# EasyEDA schematic EasyEDA_Source.json
TITLE: Meadow CCM Add-on Module - Solar, Power, Battery; REV: v1.d; Date: 2022.04; Sheet: 1/1; Drawn By: bryan costanich; Company: Wilderness Labs
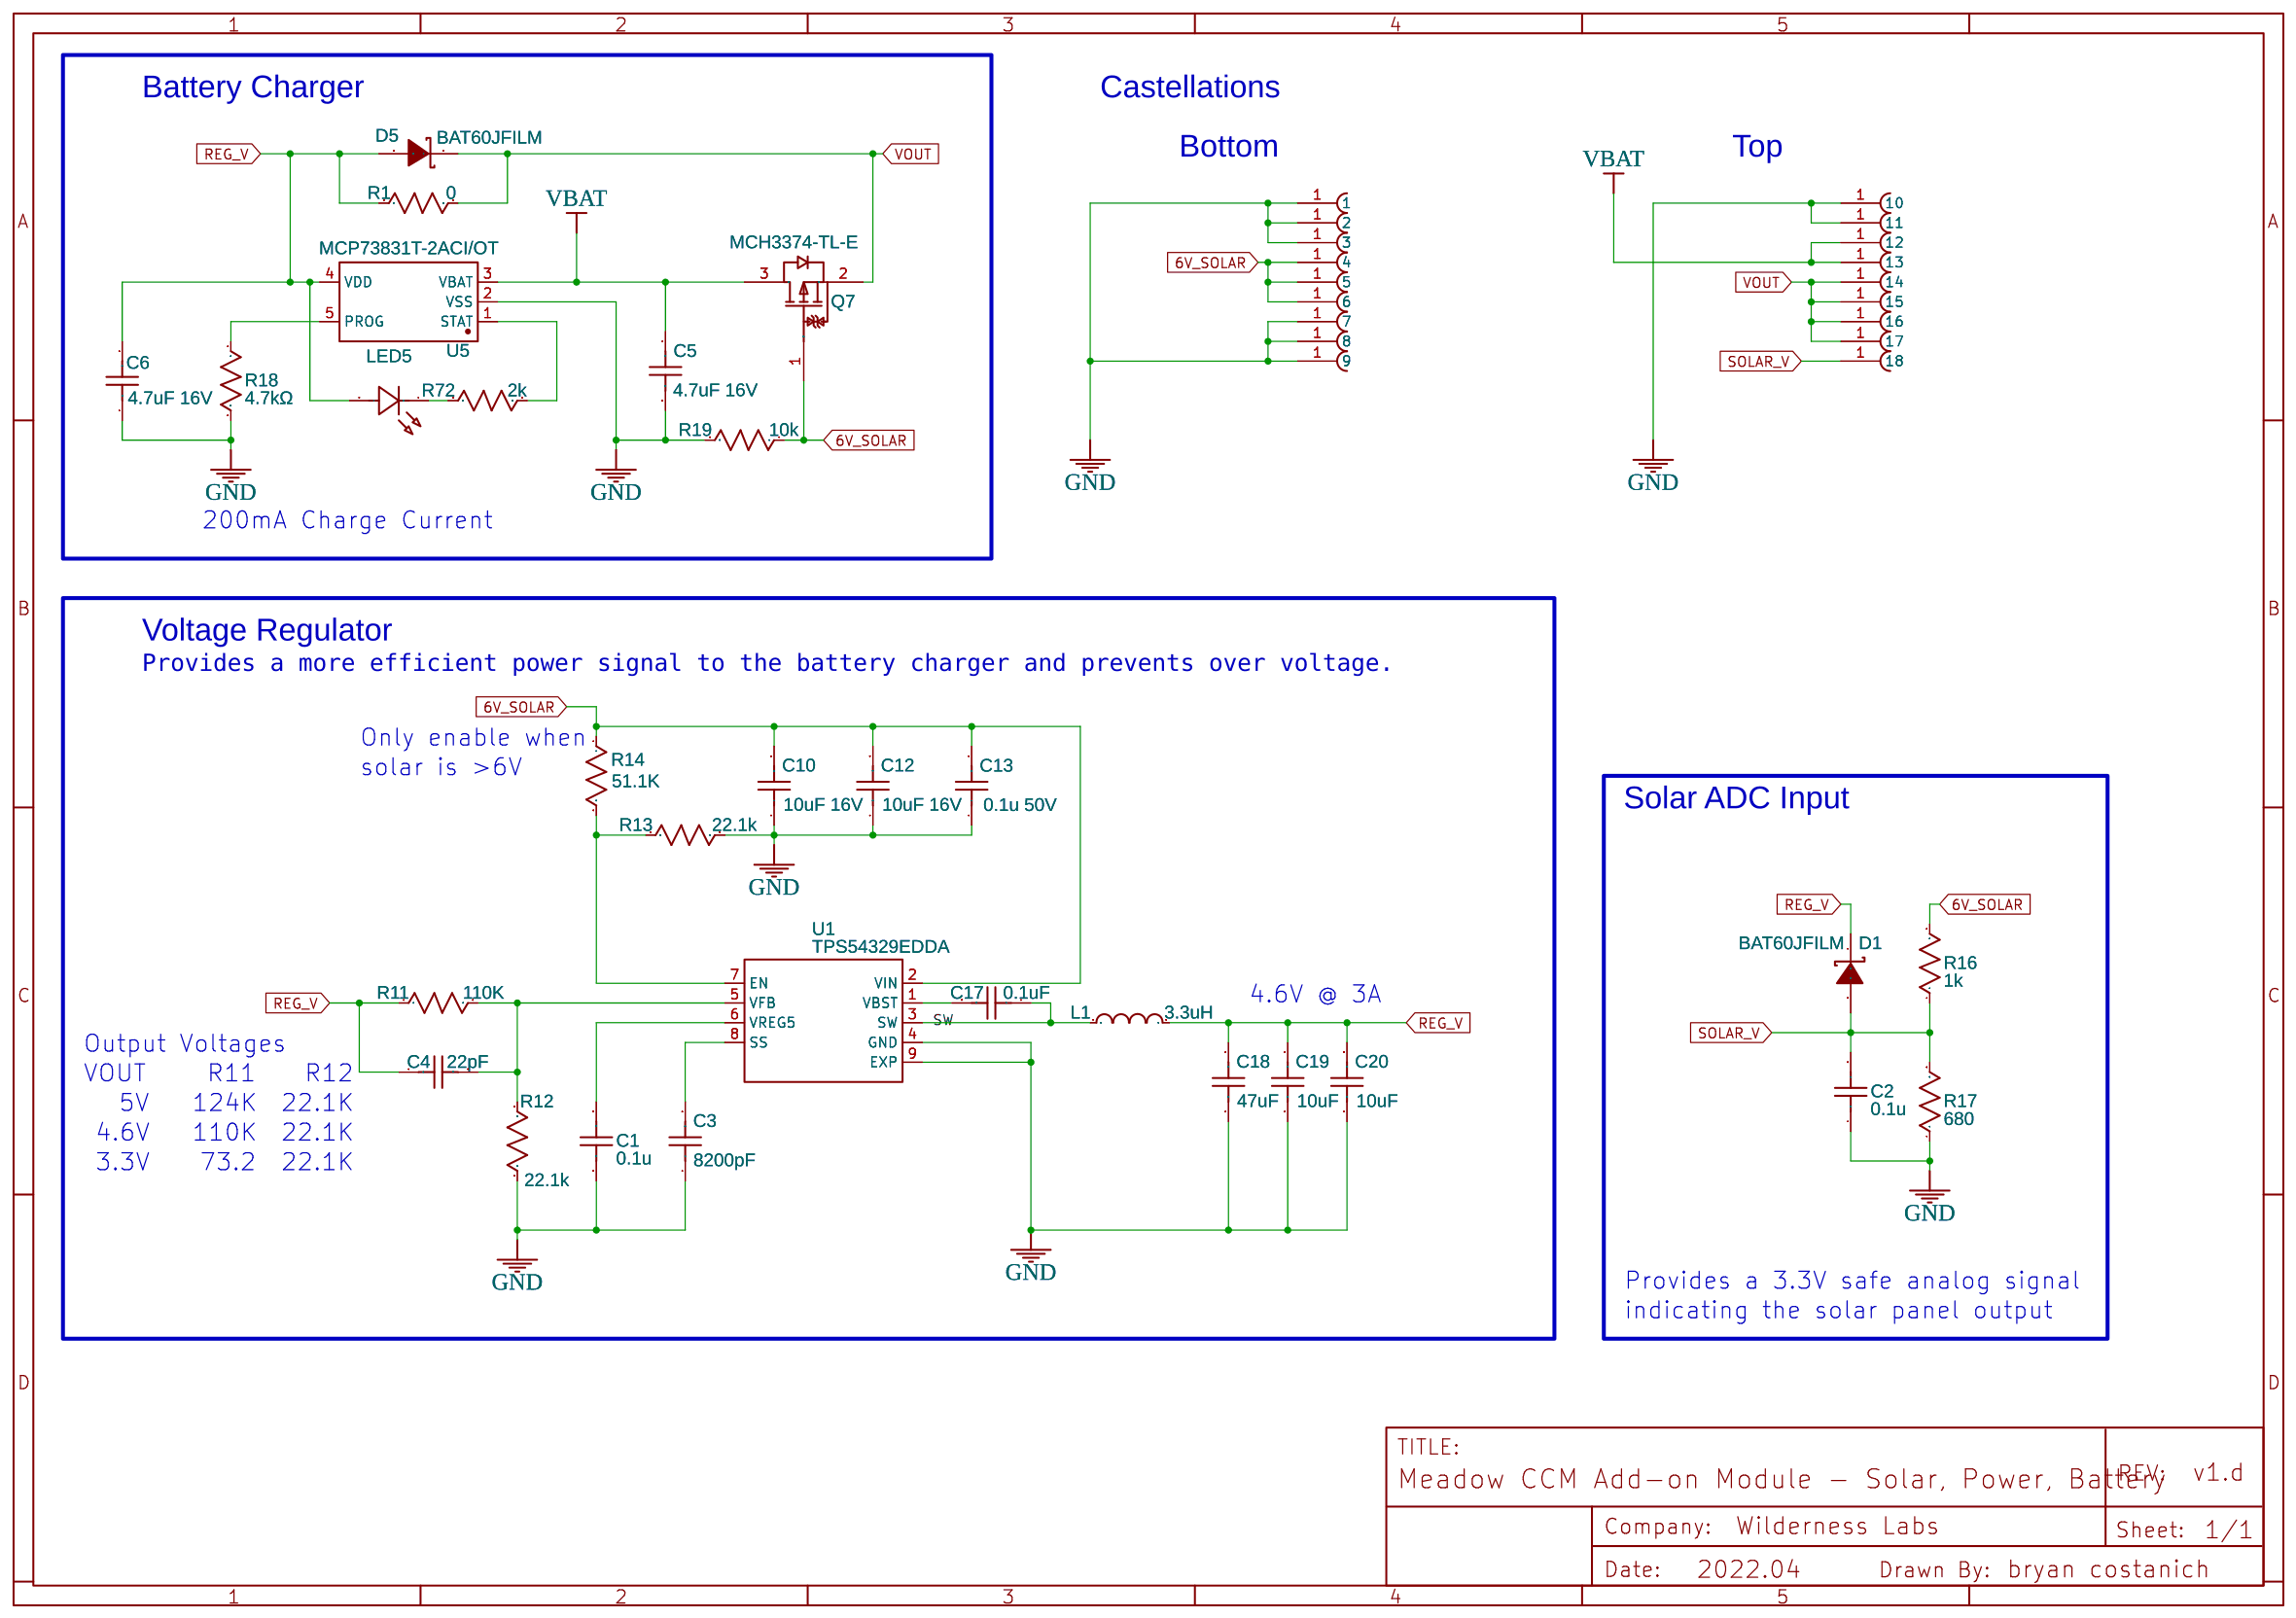
[diagram p0: schematic sheet]

## Parts
C1  0.1u  [C0603]
C2  0.1u  [C0603]
C3  8200pF  [C0603]
C4  22pF  [C0603]
C5  4.7uF 16V  [C0805]
C6  4.7uF 16V  [C0805]
C10  10uF 16V  [C0805]
C12  10uF 16V  [C0805]
C13  0.1u 50V  [C0603]
C17  0.1uF  [C0603]
C18  47uF  [C1210]
C19  10uF  [C0805]
C20  10uF  [C0805]
D1  BAT60JFILM  [SOD-323_L1.8-W1.3-LS2.5-RD]
D5  BAT60JFILM  [SOD-323_L1.8-W1.3-LS2.5-RD]
L1  3.3uH  [IND-SMD_L4.9-W4.9_NRS50XX]
LED5  EAST1608GA0  [LED0603-RD]
Q7  MCH3374-TL-E  [-ONSC-MCPH-3_V]
R1  0  [R0603]
R11  110K  [R0603]
R12  22.1k  [R0603]
R13  22.1k  [R0603]
R14  51.1K  [R0603]
R16  1k  [R0603]
R17  680  [R0603]
R18  4.7kΩ  [R0603]
R19  10k  [R0603]
R72  2k  [R0603]
U1  TPS54329EDDA  [SOIC-8_L5.0-W4.0-P1.27-LS6.0-BL-EP2.0]
U2  1.5MM SMT CASTELLATION  [1.5MM SMT CASTELLATION]
U3  1.5MM SMT CASTELLATION  [1.5MM SMT CASTELLATION]
U4  1.5MM SMT CASTELLATION  [1.5MM SMT CASTELLATION]
U5  MCP73831T-2ACI/OT  [SOT-23-5_L3.0-W1.7-P0.95-LS2.8-BR]
U6  1.5MM SMT CASTELLATION  [1.5MM SMT CASTELLATION]
U7  1.5MM SMT CASTELLATION  [1.5MM SMT CASTELLATION]
U8  1.5MM SMT CASTELLATION  [1.5MM SMT CASTELLATION]
U9  1.5MM SMT CASTELLATION  [1.5MM SMT CASTELLATION]
U10  1.5MM SMT CASTELLATION  [1.5MM SMT CASTELLATION]
U19  1.5MM SMT CASTELLATION  [1.5MM SMT CASTELLATION]
U20  1.5MM SMT CASTELLATION  [1.5MM SMT CASTELLATION]
U28  1.5MM SMT CASTELLATION  [1.5MM SMT CASTELLATION]
U29  1.5MM SMT CASTELLATION  [1.5MM SMT CASTELLATION]
U32  1.5MM SMT CASTELLATION  [1.5MM SMT CASTELLATION]
U33  1.5MM SMT CASTELLATION  [1.5MM SMT CASTELLATION]
U34  1.5MM SMT CASTELLATION  [1.5MM SMT CASTELLATION]
U35  1.5MM SMT CASTELLATION  [1.5MM SMT CASTELLATION]
U36  1.5MM SMT CASTELLATION  [1.5MM SMT CASTELLATION]
U37  1.5MM SMT CASTELLATION  [1.5MM SMT CASTELLATION]

## Library data of the parts
C1 C2 C13 C17 = C_0402_US: Contributor: LCEDA_Lib; Manufacturer Part: CC0603KRX7R9BB103; Manufacturer: Yageo
C3 = C_0603_US: Contributor: LCEDA_Lib; Manufacturer Part: CC0603KRX7R9BB822; Manufacturer: Yageo
C4 = C_0603_US: Contributor: LCEDA_Lib; Manufacturer Part: CC0603JRNPO9BN220; Manufacturer: Yageo
C5 C6 = C_0805_US: Contributor: LCEDA_Lib; Manufacturer Part: CC0805KKX7R7BB475; Manufacturer: Yageo
C10 C12 C19 C20 = C_0805_US: Contributor: LCEDA_Lib; Manufacturer Part: CC0805KRX5R7BB106; Manufacturer: Yageo
C18 = C_0402_US: Contributor: LCEDA_Lib; Manufacturer Part: CC1210KKX5R6BB476; Manufacturer: Yageo
D1 D5 = BAT60JFILM: Supplier: LCSC; Manufacturer: STMicroelectronics; Contributor: LCSC; Supplier Part: C133103; JLCPCB Part Class: Extended Part
L1 = NRS5040T3R3NMGJ: Supplier: LCSC; Supplier Part: C222946; Manufacturer: Taiyo Yuden; Contributor: LCSC; JLCPCB Part Class: Extended Part
LED5 = EAST1608GA0: Manufacturer: Everlight; Contributor: LCSC
Q7 = MCH3374-TL-E: P-Channel Power MOSFET, -12 V, -3 A, 70 mOhm, 3-Pin MCPH, Pb-Free, Tape and Reel; Manufacturer: OnSemi
R1 = R_0603_US: Contributor: LCEDA_Lib; Manufacturer Part: RC0603JR-070RL; Manufacturer: Yageo
R11 = R_0603_US: Contributor: LCEDA_Lib; Manufacturer Part: RC0603FR-07110KL; Manufacturer: Yageo
R12 R13 = R_0603_US: Contributor: LCEDA_Lib; Manufacturer Part: RC0603FR-0722K1L; Manufacturer: Yageo
R14 = R_0603_US: Contributor: LCEDA_Lib; Manufacturer Part: RC0603FR-0751K1L; Manufacturer: Yageo
R16 = R_0402_US: Contributor: LCEDA_Lib; Manufacturer Part: RC0603FR-071KL; Manufacturer: Yageo
R17 = R_0402_US: Contributor: LCEDA_Lib; Manufacturer Part: RC0603FR-07680RL; Manufacturer: Yageo
R18 = Res_0603(1/10W)_US: Manufacturer Part: RC0603FR-074K7L; Manufacturer: Yageo
R19 = R_0402_US: Contributor: LCEDA_Lib; Manufacturer Part: RC0603FR-0710KL; Manufacturer: Yageo
R72 = R_0603_US: Contributor: LCEDA_Lib; Manufacturer Part: RC0603FR-072KL; Manufacturer: Yageo
U1 = TPS54329EDDAR LOGICAL: Supplier: LCSC; Manufacturer: TI; Contributor: LCSC; Supplier Part: C38344; JLCPCB Part Class: Extended Part
U2-U4 U6-U10 U19 U20 U28 U29 U32-U37 = 1.5MM SMT CASTELLATION: Contributor: bryan_6020
U5 = MCP73831T-2ACI/OT: Supplier: LCSC; Supplier Part: C424093; Manufacturer: Microchip Tech; Contributor: LCSC; JLCPCB Part Class: Extended Part

## Nets
6V_SOLAR: C10.2 C12.2 C13.2 Q7.1(G) R14.1 R16.2 R19.1 U1.2(VIN) U32.1(6) U33.1(5) U34.1(4)
GND: C1.1 C2.1 C3.1 C5.2 C6.1 C10.1 C12.1 C13.1 C18.1 C19.1 C20.1 R12.1 R13.1 R17.1 R18.2 R19.2 U1.4(GND) U1.9(EXP) U3.1(7) U5.2(VSS) U19.1(8) U20.1(9) U28.1(10) U29.1(11) U35.1 U36.1(2) U37.1(3)
VBAT: C5.1 Q7.3(D) U2.1(12) U5.3(VBAT) U9.1(13)
REG_V: C4.1 C6.2 C18.2 C19.2 C20.2 D1.1(K) D5.2(A) L1.2 LED5.2(A) R1.1 R11.1 U5.4(VDD)
SOLAR_V: C2.2 D1.2(A) R16.1 R17.2 U6.1(18)
SW: C17.1 L1.1 U1.3(SW)
VOUT: D5.1(K) Q7.2(S) R1.2 U4.1(17) U7.1(15) U8.1(16) U10.1(14)
Net-(C1-2): C1.2 U1.6(VREG5)
Net-(C3-2): C3.2 U1.8(SS)
Net-(C4-2): C4.2 R11.2 R12.2 U1.5(VFB)
Net-(C17-2): C17.2 U1.1(VBST)
Net-(LED5-1): LED5.1(K) R72.1
Net-(R13-2): R13.2 R14.2 U1.7(EN)
Net-(R18-1): R18.1 U5.5(PROG)
Net-(R72-2): R72.2 U5.1(STAT)

## Notes on the sheet
- Battery Charger
- Castellations
- Bottom
- Top
- 200mA Charge Current
- Voltage Regulator
- Provides a more efficient power signal to the battery charger and prevents over voltage.
- Only enable when
- solar is >6V
- Solar ADC Input
- 4.6V @ 3A
- Output Voltages
- VOUT
- R11
- R12
- 5V
- 124K
- 22.1K
- 4.6V
- 110K
- 22.1K
- 3.3V
- 73.2
- 22.1K
- Provides a 3.3V safe analog signal
- indicating the solar panel output
